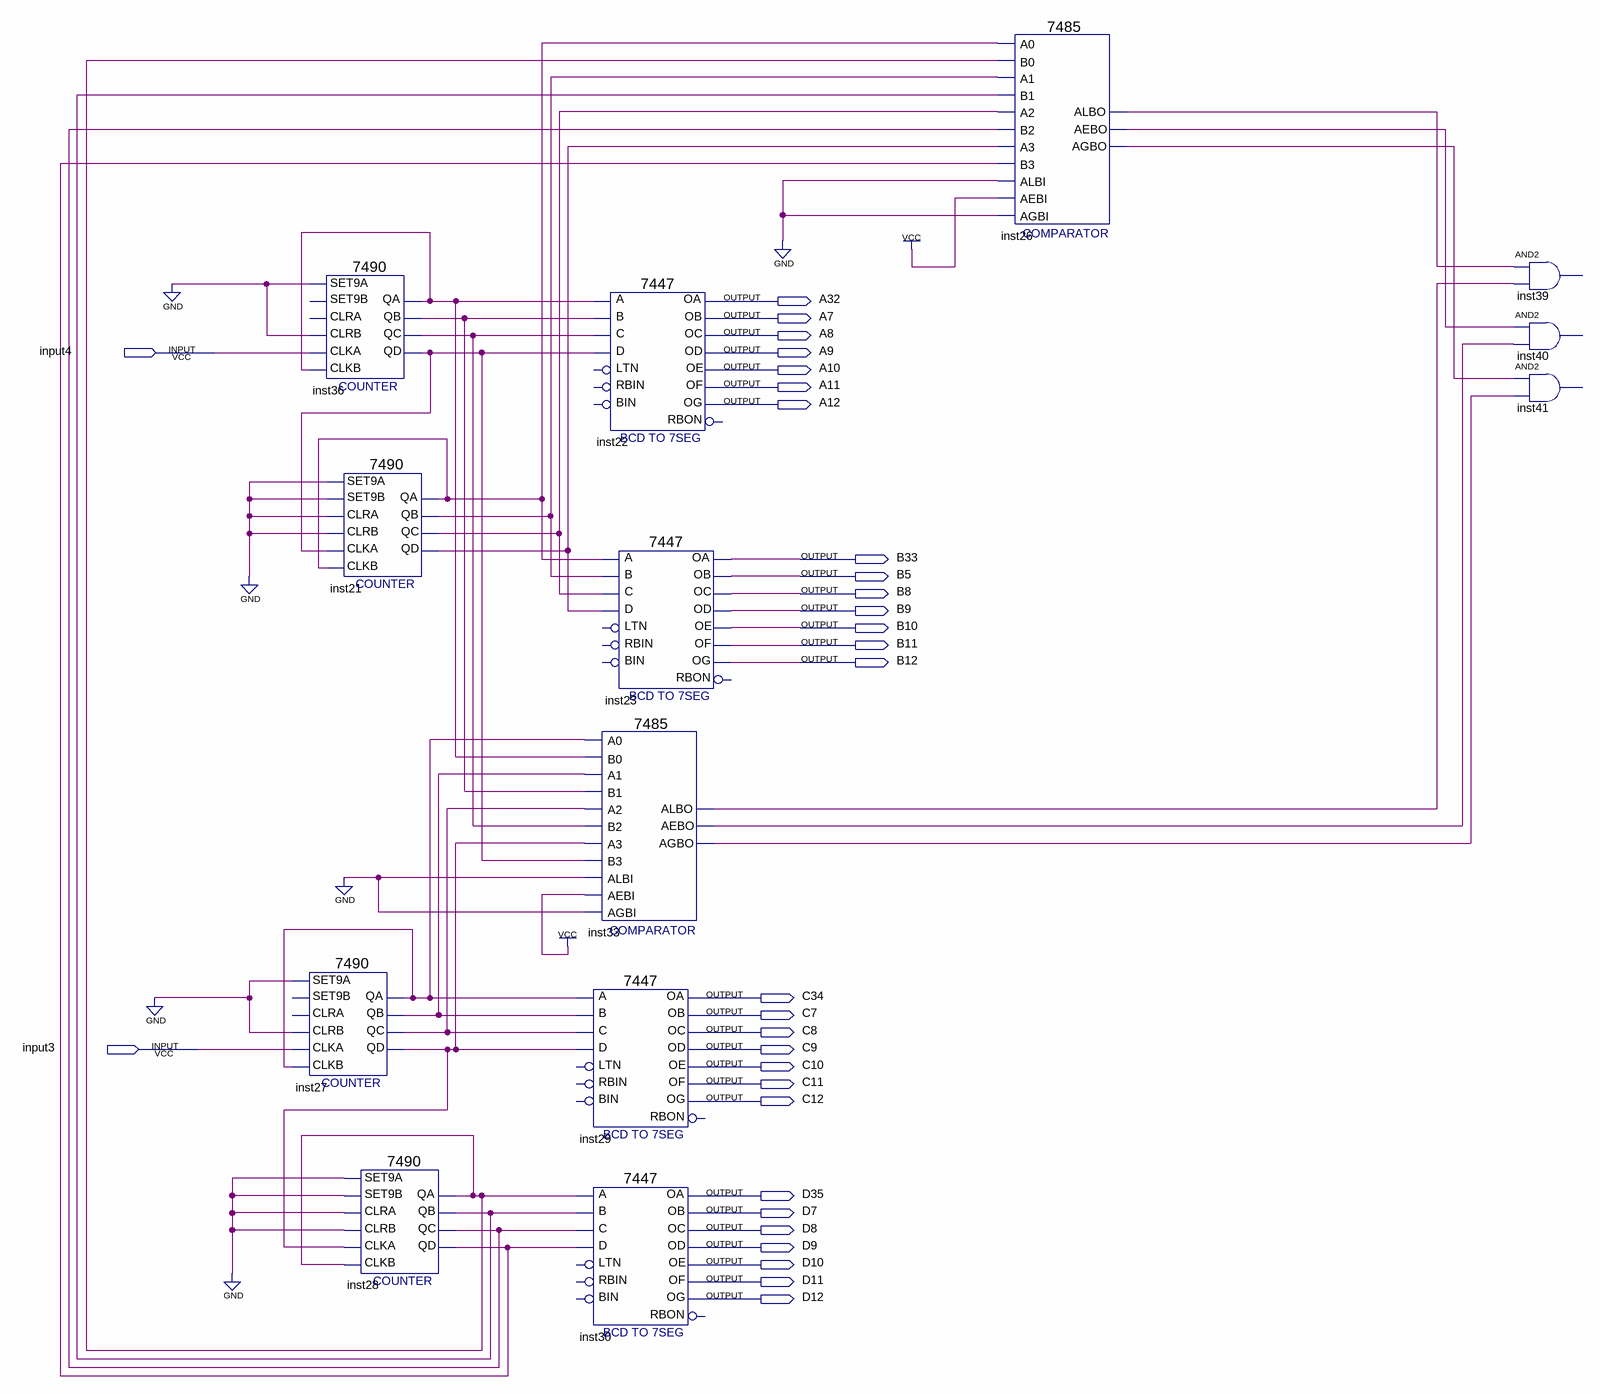
[diagram p0: schematic sheet]
// Quartus schematic comparadorprueba2.bdf as structural Verilog: 13 symbols, 30 pins
module comparadorprueba2 (
  input  input4,
  input  input3,
  output A32,
  output A7,
  output A8,
  output A9,
  output A10,
  output A11,
  output A12,
  output B33,
  output B5,
  output B8,
  output B9,
  output B10,
  output B11,
  output B12,
  output C34,
  output C7,
  output C8,
  output C9,
  output C10,
  output C11,
  output C12,
  output D35,
  output D7,
  output D8,
  output D9,
  output D10,
  output D11,
  output D12
);

  wire inst21_qa, inst21_qb, inst21_qc, inst21_qd, inst26_aebo, inst26_agbo, inst26_albo, inst27_qa,
       inst27_qb, inst27_qc, inst27_qd, inst28_qa, inst28_qb, inst28_qc, inst28_qd, inst33_aebo, inst33_agbo,
       inst33_albo, inst36_qa, inst36_qb, inst36_qc, inst36_qd;

  \7490  inst36 (
    .SET9A(1'b0), .CLKB(inst36_qa), .CLKA(input4), .CLRB(1'b0), .QD(inst36_qd), .QA(inst36_qa),
    .QB(inst36_qb), .QC(inst36_qc));  // open: CLRA, SET9B
  \7490  inst21 (
    .SET9A(1'b0), .CLRA(1'b0), .SET9B(1'b0), .CLKB(inst21_qa), .CLKA(inst36_qd), .CLRB(1'b0), .QD(inst21_qd),
    .QA(inst21_qa), .QB(inst21_qb), .QC(inst21_qc));
  \7490  inst27 (
    .SET9A(1'b0), .CLKB(inst27_qa), .CLKA(input3), .CLRB(1'b0), .QD(inst27_qd), .QA(inst27_qa),
    .QB(inst27_qb), .QC(inst27_qc));  // open: CLRA, SET9B
  \7490  inst28 (
    .SET9A(1'b0), .CLRA(1'b0), .SET9B(1'b0), .CLKB(inst28_qa), .CLKA(inst27_qd), .CLRB(1'b0), .QD(inst28_qd),
    .QA(inst28_qa), .QB(inst28_qb), .QC(inst28_qc));
  \7447  inst22 (
    .B(inst36_qb), .C(inst36_qc), .D(inst36_qd), .A(inst36_qa), .OB(A7), .OC(A8), .OE(A10), .OD(A9),
    .OF(A11), .OG(A12), .OA(A32));  // open: LTN, RBIN, BIN, RBON
  \7447  inst23 (
    .B(inst21_qb), .C(inst21_qc), .D(inst21_qd), .A(inst21_qa), .OB(B5), .OC(B8), .OE(B10), .OD(B9),
    .OF(B11), .OG(B12), .OA(B33));  // open: LTN, RBIN, BIN, RBON
  \7485  inst33 (
    .A3(inst27_qd), .B2(inst36_qc), .A2(inst27_qc), .AEBI(1'b1), .AGBI(1'b0), .ALBI(1'b0), .A0(inst27_qa),
    .B0(inst36_qa), .B3(inst36_qd), .A1(inst27_qb), .B1(inst36_qb), .ALBO(inst33_albo), .AGBO(inst33_agbo),
    .AEBO(inst33_aebo));
  \7447  inst29 (
    .B(inst27_qb), .C(inst27_qc), .D(inst27_qd), .A(inst27_qa), .OB(C7), .OC(C8), .OE(C10), .OD(C9),
    .OF(C11), .OG(C12), .OA(C34));  // open: LTN, RBIN, BIN, RBON
  \7447  inst30 (
    .B(inst28_qb), .C(inst28_qc), .D(inst28_qd), .A(inst28_qa), .OB(D7), .OC(D8), .OE(D10), .OD(D9),
    .OF(D11), .OG(D12), .OA(D35));  // open: LTN, RBIN, BIN, RBON
  \7485  inst26 (
    .A3(inst21_qd), .B2(inst28_qc), .A2(inst21_qc), .AEBI(1'b1), .AGBI(1'b0), .ALBI(1'b0), .A0(inst21_qa),
    .B0(inst28_qa), .B3(inst28_qd), .A1(inst21_qb), .B1(inst28_qb), .ALBO(inst26_albo), .AGBO(inst26_agbo),
    .AEBO(inst26_aebo));
  // AND2 inst39 has open pins: IN1=inst26_albo, IN2=inst33_albo, OUT=open
  // AND2 inst40 has open pins: IN1=inst26_aebo, IN2=inst33_aebo, OUT=open
  // AND2 inst41 has open pins: IN1=inst26_agbo, IN2=inst33_agbo, OUT=open
endmodule
